# EasyEDA schematic schematic.json
TITLE: Sheet_1; REV: 1.0; Date: 2021-01-09; Sheet: 1/1; Drawn By: gabrielbolzani; Company: Your Company
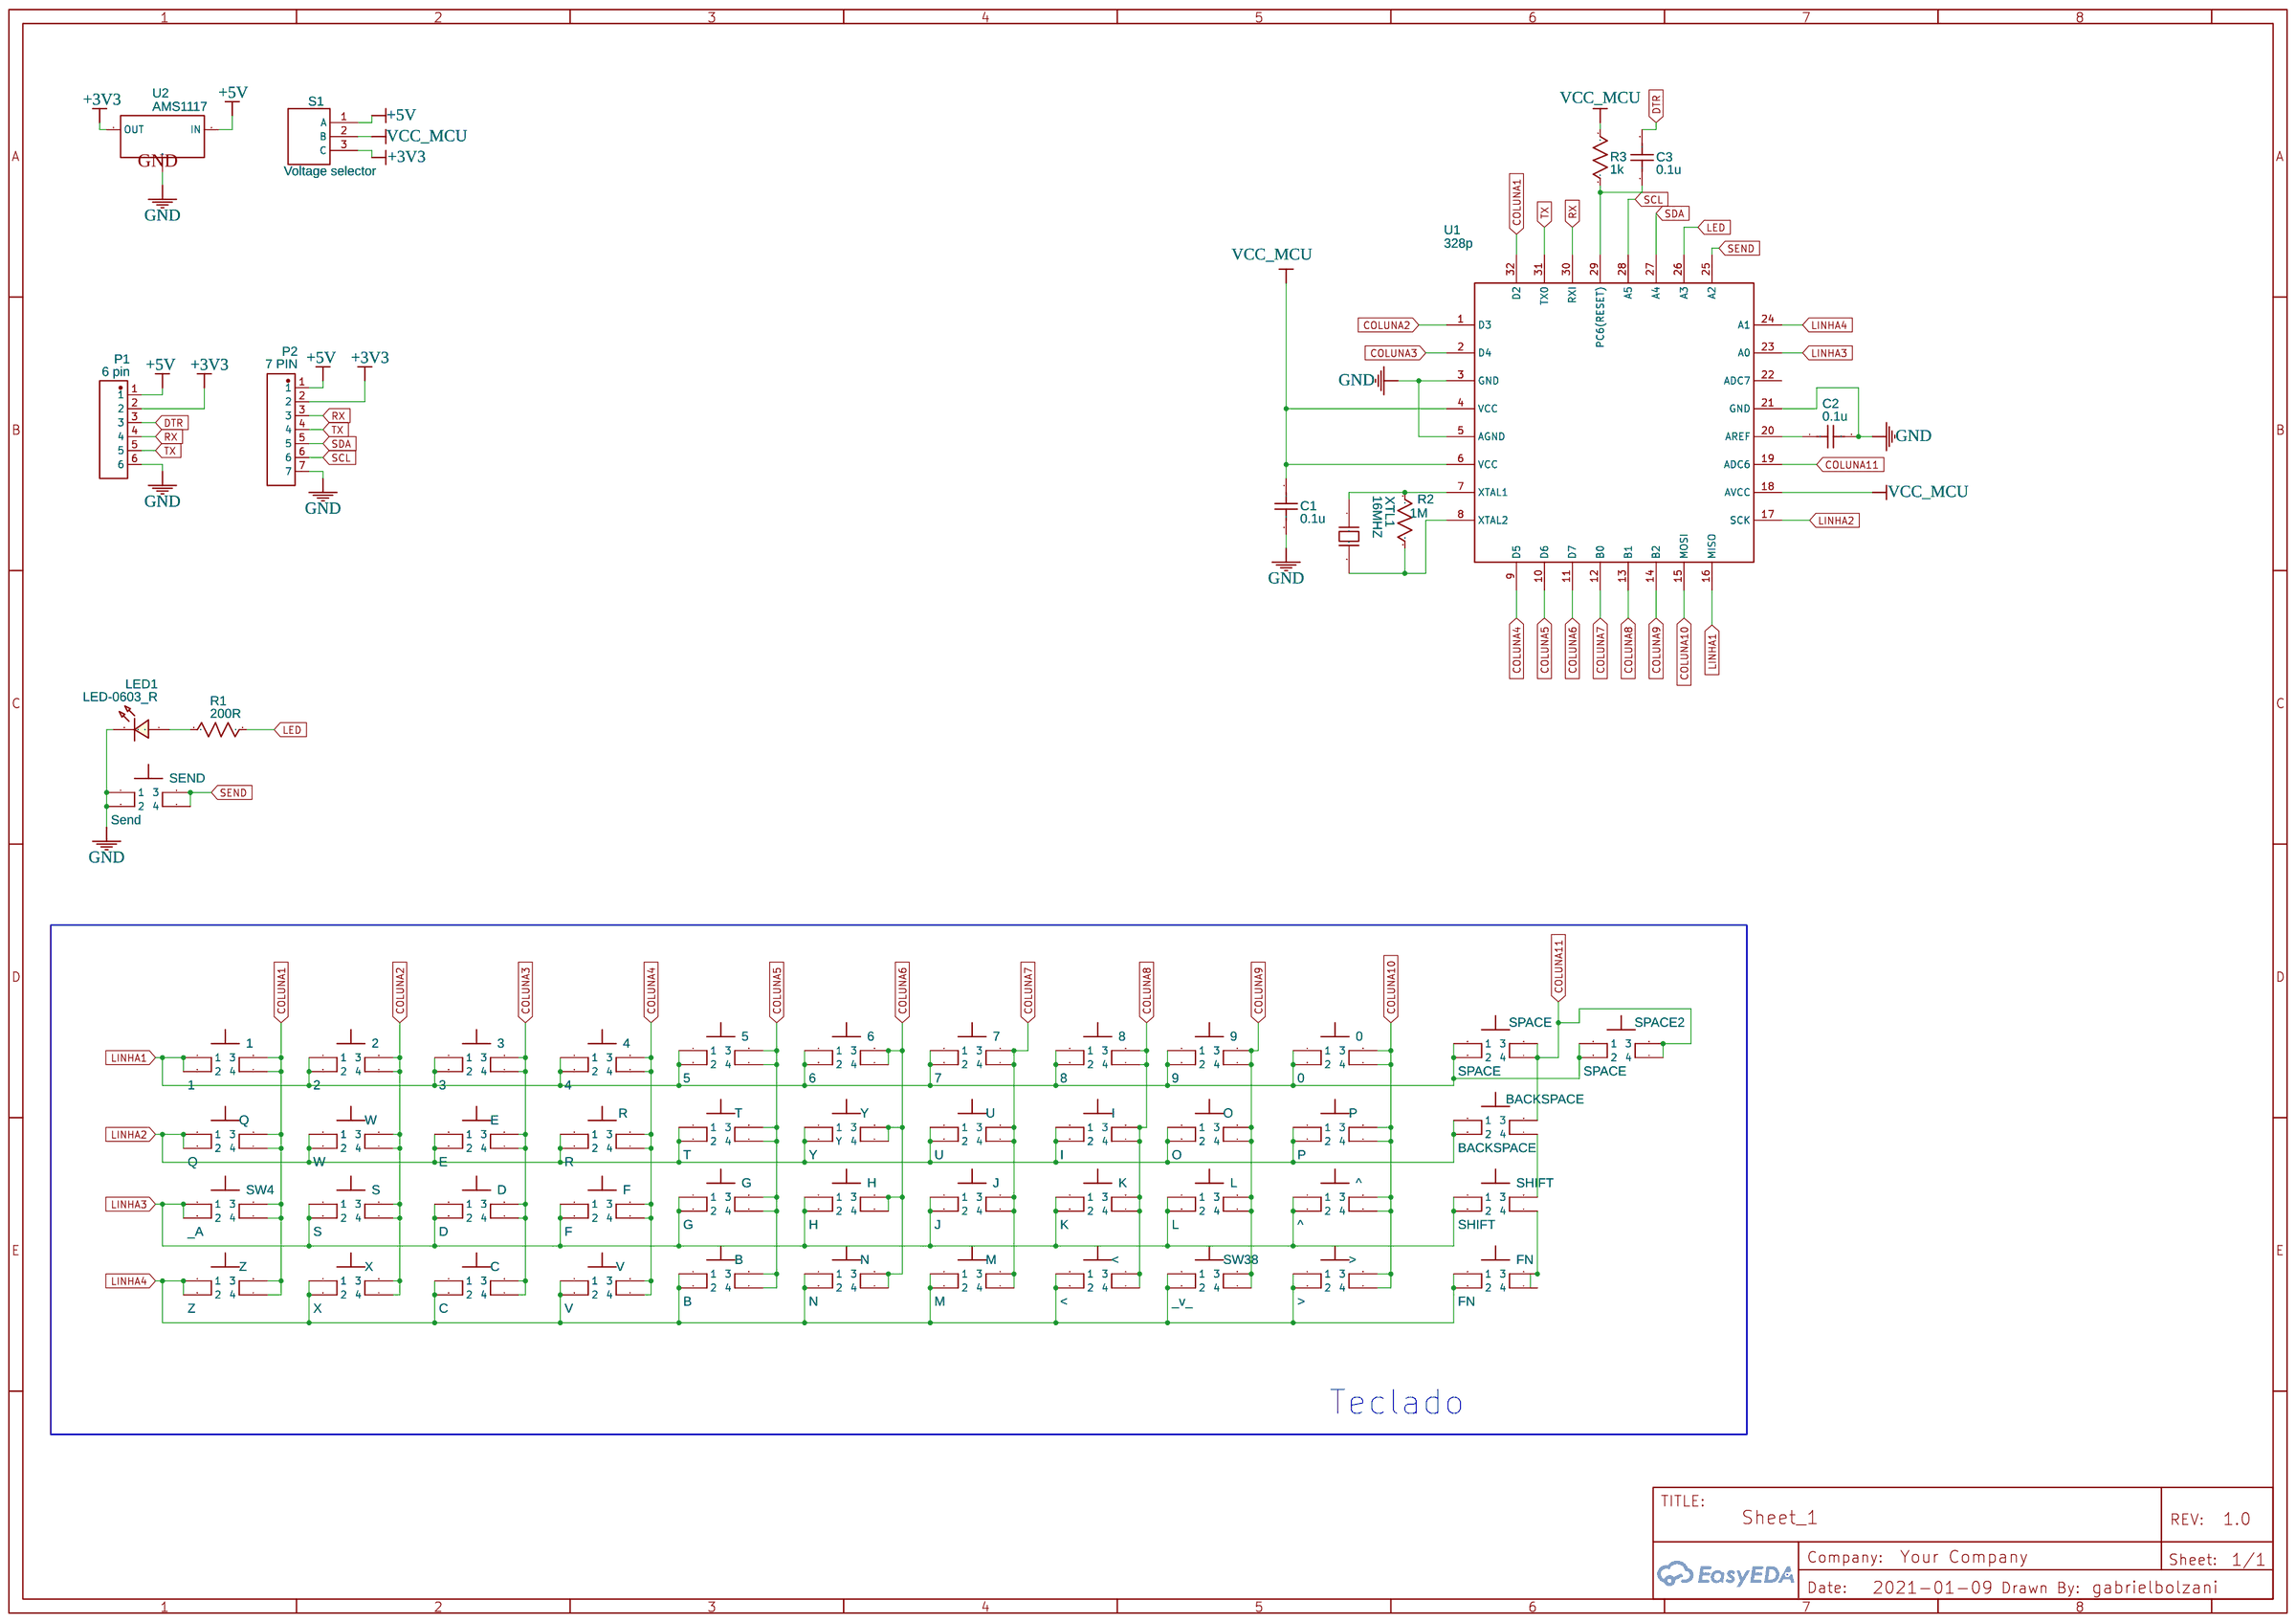
[diagram p0: schematic sheet]

## Parts
0  0  [PUSH BUTTON 4 PIN DIP]
1  1  [PUSH BUTTON 4 PIN DIP]
2  2  [PUSH BUTTON 4 PIN DIP]
3  3  [PUSH BUTTON 4 PIN DIP]
4  4  [PUSH BUTTON 4 PIN DIP]
5  5  [PUSH BUTTON 4 PIN DIP]
6  6  [PUSH BUTTON 4 PIN DIP]
7  7  [PUSH BUTTON 4 PIN DIP]
8  8  [PUSH BUTTON 4 PIN DIP]
9  9  [PUSH BUTTON 4 PIN DIP]
&#94;  ^  [PUSH BUTTON 4 PIN DIP]
<  <  [PUSH BUTTON 4 PIN DIP]
>  >  [PUSH BUTTON 4 PIN DIP]
^  ^
B  B  [PUSH BUTTON 4 PIN DIP]
BACKSPACE  BACKSPACE  [PUSH BUTTON 4 PIN DIP]
C  C  [PUSH BUTTON 4 PIN DIP]
C1  0.1u  [C0603]
C2  0.1u  [C0603]
C3  0.1u  [C0603]
D  D  [PUSH BUTTON 4 PIN DIP]
E  E  [PUSH BUTTON 4 PIN DIP]
F  F  [PUSH BUTTON 4 PIN DIP]
FN  FN  [PUSH BUTTON 4 PIN DIP]
G  G  [PUSH BUTTON 4 PIN DIP]
H  H  [PUSH BUTTON 4 PIN DIP]
I  I  [PUSH BUTTON 4 PIN DIP]
J  J  [PUSH BUTTON 4 PIN DIP]
K  K  [PUSH BUTTON 4 PIN DIP]
L  L  [PUSH BUTTON 4 PIN DIP]
LED1  LED-0603_R  [LED0603_RED]
M  M  [PUSH BUTTON 4 PIN DIP]
N  N  [PUSH BUTTON 4 PIN DIP]
O  O  [PUSH BUTTON 4 PIN DIP]
P  P  [PUSH BUTTON 4 PIN DIP]
P1  6 pin  [PINHEAD-1X06]
P2  7 PIN  [PIN_SOCKET_7]
Q  Q  [PUSH BUTTON 4 PIN DIP]
R  R  [PUSH BUTTON 4 PIN DIP]
R1  200R  [R0603]
R2  1M  [R0603]
R3  1k  [R0603]
S  S  [PUSH BUTTON 4 PIN DIP]
S1  Voltage selector  [PIN_HEADER_STRAIGHT_1X03_PITCH2.00MM_SMD_PIN1LEFT]
SEND  Send  [PUSH BUTTON 4 PIN DIP]
SHIFT  SHIFT  [PUSH BUTTON 4 PIN DIP]
SPACE  SPACE  [PUSH BUTTON 4 PIN DIP]
SPACE2  SPACE  [PUSH BUTTON 4 PIN DIP]
SW4  _A  [PUSH BUTTON 4 PIN DIP]
SW38  _v_  [PUSH BUTTON 4 PIN DIP]
T  T  [PUSH BUTTON 4 PIN DIP]
U  U  [PUSH BUTTON 4 PIN DIP]
U1  328p  [TQFP32]
U2  AMS1117  [SOT-223]
V  V  [PUSH BUTTON 4 PIN DIP]
W  W  [PUSH BUTTON 4 PIN DIP]
X  X  [PUSH BUTTON 4 PIN DIP]
XTL1  16MHZ  [16MHZ_CRYSTAL_SMD]
Y  Y  [PUSH BUTTON 4 PIN DIP]
Z  Z  [PUSH BUTTON 4 PIN DIP]

## Library data of the parts
0-9 &#94; < > B BACKSPACE C D E F FN G H I J K L M N O P Q R S SEND SHIFT SPACE SPACE2 SW4 SW38 T U V W X Y Z = PUSHBUTTON 4 PIN DIP COPY: Manufacturer Part: Pushbutton; Contributor: elnino; Supplier: LAMINGTON
^ = PUSHBUTTON 4 PIN DIP COPY_35: Manufacturer Part: Pushbutton; Supplier: LAMINGTON
C1-C3 = C_0603_US: Contributor: LCEDA_Lib
LED1 = LED-0603_R: Manufacturer: EVERLIGHT(台湾亿光); Manufacturer Part: 19-217/R6C-AL1M2VY/3T; Supplier Part: C72044; Supplier: LCSC; Contributor: LCEDA_01
P1 = 6 pin: Contributor: Ярослав Суслов
P2 = 7 PIN: Supplier: LCSC; Supplier Part: C247920; Manufacturer: Boom Precision Elec; Manufacturer Part: C247920; Contributor: András Tóth
R1-R3 = R_0603_US: Contributor: LCEDA_Lib
S1 = 3 PIN: Manufacturer Part: 3 pin header; Contributor: Deimoss
U1 = 328p: Contributor: Viserysll; sourceId: PtZhztK2W
U2 = AMS1117: Supplier: LCSC; Manufacturer: TI; Manufacturer Part: LM1117DTX-3.3/NOPB; Supplier Part: C78471; Contributor: AMironov
XTL1 = XTL - 16MHZ: Manufacturer Part: NTPL INSIDE; Contributor: embeddedpcb2019

## Nets
+3V3: P1.2 P2.2 S1.3(C) U2.2(OUT)
+5V: P1.1 P2.1 S1.1(A) U2.3(IN)
GND: C1.2 C2.2 LED1.2 P1.6 P2.7 SEND.1 SEND.2 U1.3(GND) U1.5(AGND) U1.21(GND) U2.1(GND)
VCC_MCU: C1.1 R3.1 S1.2(B) U1.4(VCC) U1.6(VCC) U1.18(AVCC)
COLUNA1: 1.3 1.4 Q.3 Q.4 SW4.3 SW4.4 U1.32(D2) Z.3 Z.4
COLUNA2: 2.3 2.4 S.3 S.4 U1.1(D3) W.3 W.4 X.3 X.4
COLUNA3: 3.3 3.4 C.3 C.4 D.3 D.4 E.3 E.4 U1.2(D4)
COLUNA4: 4.3 4.4 F.3 F.4 R.3 R.4 U1.9(D5) V.3 V.4
COLUNA5: 5.3 5.4 B.3 B.4 G.3 G.4 T.3 T.4 U1.10(D6)
COLUNA6: 6.3 6.4 H.3 H.4 N.3 N.4 U1.11(D7) Y.3 Y.4
COLUNA7: 7.3 7.4 J.3 J.4 M.3 M.4 U.3 U.4 U1.12(B0)
COLUNA8: 8.3 8.4 <.3 <.4 I.3 I.4 K.3 K.4 U1.13(B1)
COLUNA9: 9.3 9.4 L.3 L.4 O.3 O.4 SW38.3 SW38.4 U1.14(B2)
COLUNA10: 0.3 0.4 &#94;.3 &#94;.4 >.3 >.4 P.3 P.4 U1.15(MOSI)
COLUNA11: BACKSPACE.3 SPACE.3 SPACE.4 SPACE2.3 SPACE2.4 U1.19(ADC6)
DTR: C3.2 P1.3
LED: R1.2 U1.26(A3)
LINHA1: 0.1 0.2 1.1 1.2 2.1 2.2 3.1 3.2 4.1 4.2 5.1 5.2 6.1 6.2 7.1 7.2 8.1 8.2 9.1 9.2 SPACE.1 SPACE.2 SPACE2.1 SPACE2.2 U1.16(MISO)
LINHA2: BACKSPACE.1 BACKSPACE.2 E.1 E.2 I.1 I.2 O.1 O.2 P.1 P.2 Q.1 Q.2 R.1 R.2 T.1 T.2 U.1 U.2 U1.17(SCK) W.1 W.2 Y.1 Y.2(Y)
LINHA3: &#94;.1 &#94;.2 D.1 D.2 F.1 F.2 G.1 G.2 H.1 H.2 J.1 J.2 K.1 K.2 L.1 L.2 S.1 S.2 SHIFT.1 SHIFT.2 SW4.1 SW4.2 U1.23(A0)
LINHA4: <.1 <.2 >.1 >.2 B.1 B.2 C.1 C.2 FN.1 FN.2 M.1 M.2 N.1 N.2 SW38.1 SW38.2 U1.24(A1) V.1 V.2 X.1 X.2 Z.1 Z.2
RX: P1.4 P2.3 U1.30(RXI)
SCL: P2.6 U1.28(A5)
SDA: P2.5 U1.27(A4)
SEND: SEND.3 SEND.4 U1.25(A2)
TX: P1.5 P2.4 U1.31(TX0)
Net-(BACKSPACE-4): BACKSPACE.4 SHIFT.3
Net-(C2-1): C2.1 U1.20(AREF)
Net-(C3-1): C3.1 R3.2 U1.29(PC6(RESET))
Net-(FN-3): FN.3 FN.4 SHIFT.4
Net-(LED1-1): LED1.1 R1.1
Net-(R2-1): R2.1 U1.7(XTAL1) XTL1.1
Net-(R2-2): R2.2 U1.8(XTAL2) XTL1.2

Not connected (* = marked no-connect by the designer): U1 22(ADC7)

## Notes on the sheet
- Teclado
